# Altium schematic sheet boxer_main.SchDoc: Raspberry Pi Zero W
size A4; DrawnBy: Damian Dolewski; Engineer: Damian Dolewski; DocumentNumber: 1; SheetNumber: 1; SheetTotal: 3
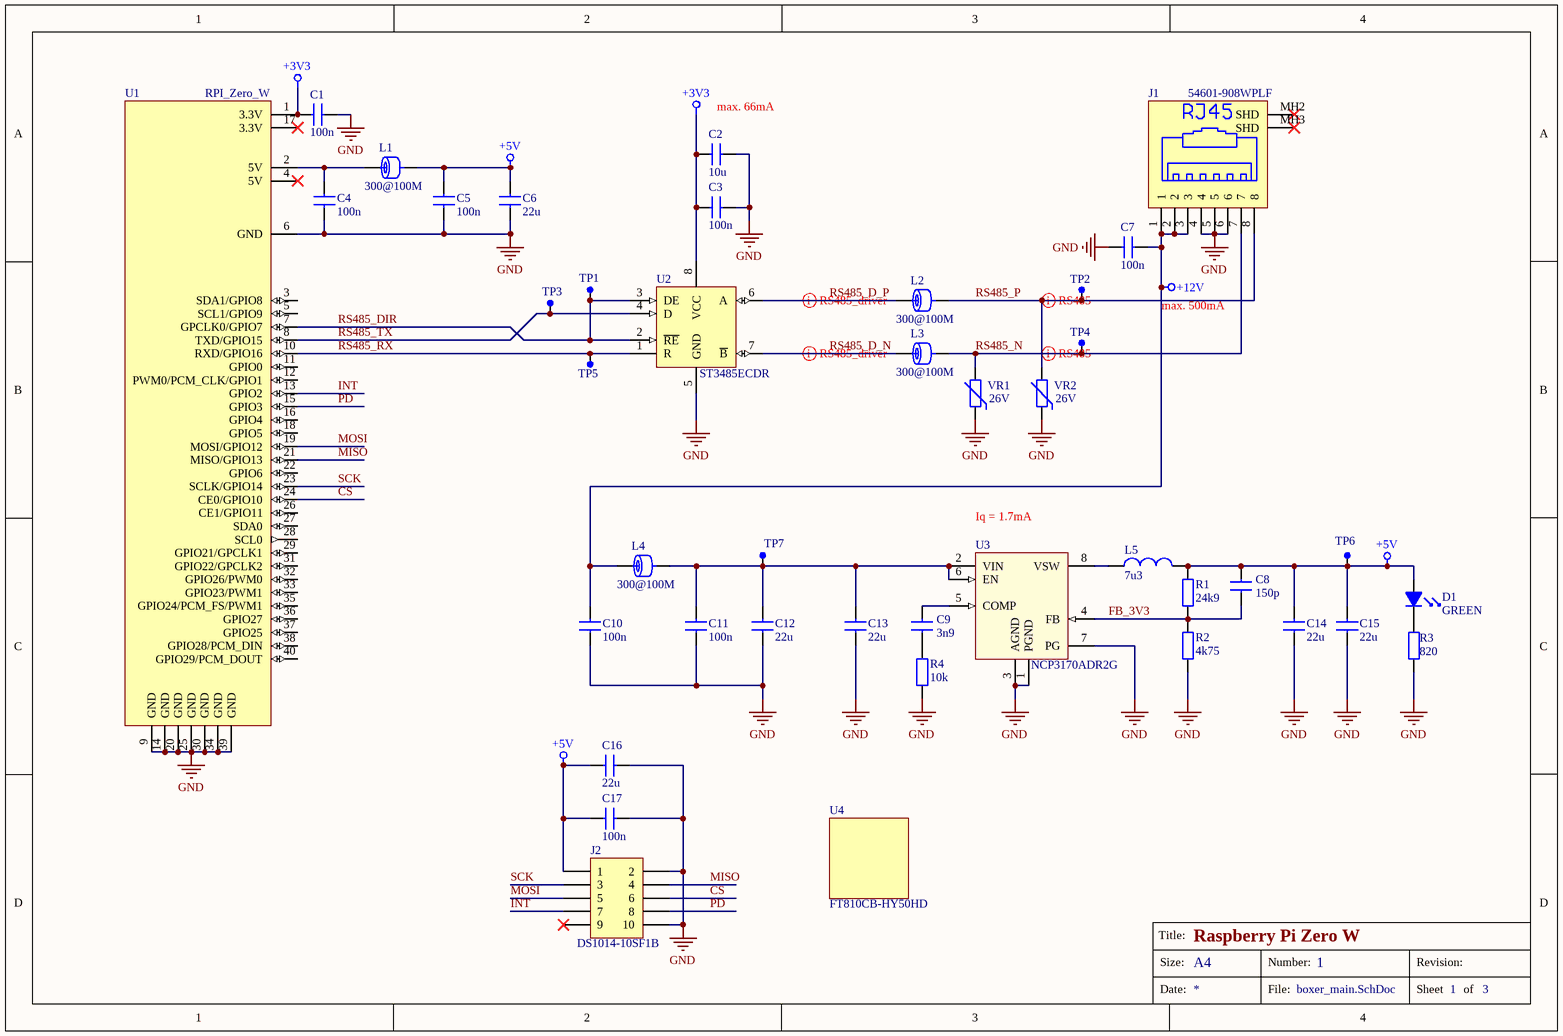
[diagram p0: boxer_main.SchDoc]

## Parts
C1  value 100n  [C_0805]  (hidden comment: Capacitor)
C2  value 10u  [C_1206]  (hidden comment: TME: CL31A226MOCLNNC)
C3  value 100n  [C_0805]  (hidden comment: Capacitor)
C4  value 100n  [C_0805]  (hidden comment: Capacitor)
C5  value 100n  [C_0805]  (hidden comment: Capacitor)
C6  value 22u  [C_1206]  (hidden comment: TME: CL31A226MOCLNNC)
C7  value 100n  [C_0805]  (hidden comment: Capacitor)
C8  value 150p  [C_0805]  (hidden comment: 885012207081)
C9  value 3n9  [C_0805]  (hidden comment: 885012207089)
C10  value 100n  [C_0805]  (hidden comment: Capacitor)
C11  value 100n  [C_0805]  (hidden comment: Capacitor)
C12  value 22u  [C_1206]  (hidden comment: TME: CL31A226MOCLNNC)
C13  value 22u  [C_1206]  (hidden comment: TME: CL31A226MOCLNNC)
C14  value 22u  [C_1206]  (hidden comment: TME: CL31A226MOCLNNC)
C15  value 22u  [C_1206]  (hidden comment: TME: CL31A226MOCLNNC)
C16  value 22u  [C_1206]  (hidden comment: TME: CL31A226MOCLNNC)
C17  value 100n  [C_0805]  (hidden comment: Capacitor)
D1  value GREEN  [LED_0805]  (hidden comment: KP-2012LSGC)
J1  54601-908WPLF  [RJ45_54601-908WPLF]
J2  value DS1014-10SF1B  [215307-5]  (hidden comment: Header 5X2)
L1  value 300@100M  [L_0805]  (hidden comment: 742792031)
L2  value 300@100M  [L_0805]  (hidden comment: 742792031)
L3  value 300@100M  [L_0805]  (hidden comment: 742792031)
L4  value 300@100M  [L_0805]  (hidden comment: 742792031)
L5  value 7u3  [L_6.7x6.7mm]  (hidden comment: 308-1500-1-ND)
R1  value 24k9  [R_0805]  (hidden comment: RNCP0805FTD24K9)
R2  value 4k75  [R_0805]  (hidden comment: RNCP0805FTD4K75)
R3  value 820  [R_0805]  (hidden comment: Resistor)
R4  value 10k  [R_1206]  (hidden comment: Resistor)
TP1  TEST PAD  [PIN]  (value not drawn)
TP2  TEST PAD  [PIN]  (value not drawn)
TP3  TEST PAD  [PIN]  (value not drawn)
TP4  TEST PAD  [PIN]  (value not drawn)
TP5  TEST PAD  [PIN]  (value not drawn)
TP6  TEST PAD  [PIN]  (value not drawn)
TP7  TEST PAD  [PIN]  (value not drawn)
U1  RPI_Zero_W  [RPI_ZERO]
U2  ST3485ECDR  [SO8]
U3  NCP3170ADR2G  [SO8]
U4  FT810CB-HY50HD  [FT810CB-HY50HD]
VR1  value 26V  [VR_0805]  (hidden comment: AMCV-0805-260-C800N-T)
VR2  value 26V  [VR_0805]  (hidden comment: AMCV-0805-260-C800N-T)

## Nets
+3V3: C1.2 C2.2 C3.1 U1.1(3.3V) U2.8(VCC)
+5V: C5.1 C6.2 C8.2 C14.2 C15.2 C16.2 C17.2 D1.1(A) J2.1 L1.2 L5.2 R1.2 TP6.1
+12V: C7.1 C10.2 J1.1 J1.2 J1.3 L4.1
GND: C1.1 C2.1 C3.2 C4.2 C5.2 C6.1 C7.2 C10.1 C11.1 C12.1 C13.1 C14.1 C15.1 C16.1 C17.1 J1.4 J1.5 J1.6 J2.2 J2.10 R2.1 R3.1 R4.1 U1.6(GND) U1.9(GND) U1.14(GND) U1.20(GND) U1.25(GND) U1.30(GND) U1.34(GND) U1.39(GND) U2.5(GND) U3.1(PGND) U3.3(AGND) U3.7(PG) VR1.2 VR2.2
CS: J2.6 U1.24(CE0/GPIO10)
FB_3V3: C8.1 R1.1 R2.2 U3.4(FB)
INT: J2.7 U1.13(GPIO2)
MISO: J2.4 U1.21(MISO/GPIO13)
MOSI: J2.5 U1.19(MOSI/GPIO12)
PD: J2.8 U1.15(GPIO3)
RS485_D_N: L3.1 U2.7(~{B})
RS485_D_P: L2.1 U2.6(A)
RS485_DIR: TP1.1 U1.7(GPCLK0/GPIO7) U2.2(~{RE}) U2.3(DE)
RS485_N: J1.7 L3.2 TP4.1 VR1.1
RS485_P: J1.8 L2.2 TP2.1 VR2.1
RS485_RX: TP5.1 U1.10(RXD/GPIO16) U2.1(R)
RS485_TX: TP3.1 U1.8(TXD/GPIO15) U2.4(D)
SCK: J2.3 U1.23(SCLK/GPIO14)
NetC4_1: C4.1 L1.1 U1.2(5V)
NetC9_1: C9.1 R4.2
NetC9_2: C9.2 U3.5(COMP)
NetC11_2: C11.2 C12.2 C13.2 L4.2 TP7.1 U3.2(VIN) U3.6(EN)
NetD1_2: D1.2(K) R3.2
NetL5_1: L5.1 U3.8(VSW)

Not connected (* = marked no-connect by the designer): J1 MH2(SHD)* MH3(SHD)*; J2 9*; U1 3(SDA1/GPIO8) 4(5V)* 5(SCL1/GPIO9) 11(GPIO0) 12(PWM0/PCM_CLK/GPIO1) 16(GPIO4) 17(3.3V)* 18(GPIO5) 22(GPIO6) 26(CE1/GPIO11) 27(SDA0) 28(SCL0) 29(GPIO21/GPCLK1) 31(GPIO22/GPCLK2) 32(GPIO26/PWM0) 33(GPIO23/PWM1) 35(GPIO24/PCM_FS/PWM1) 36(GPIO27) 37(GPIO25) 38(GPIO28/PCM_DIN) 40(GPIO29/PCM_DOUT)

## Layout directives
differential pair: RS485_D_N, RS485_D_P, RS485_N, RS485_P

## Notes on the sheet
- (near C2) max. 66mA
- max. 500mA
- (near U3) Iq = 1.7mA
- Title:
- Size:
- A4
- Number:
- Revision:
- Date:
- File:
- Sheet
- of

## Library data of the parts
C2 C6 C8 C9 C12-C16 = Capacitor
D1 = LED: Typical RED, GREEN, YELLOW, AMBER GaAs LED
J1 = RJ45-8: RJ45 Socket, 8pin, No Key, Molex MX-95001-2881; Value: 54601-908WPLF
J2 = Header 5X2: Header, 5-Pin, Dual row
L1-L4 = FB: Ferrite Bead
L5 = Inductor: FIXED IND 7.3UH 2.1A 54 MOHM SMD
R1 R2 = Resistor
TP1-TP7 = TEST_PAD: PAD 1.5mm
U1 = RPI_Zero_W: Raspberry Pi Zero W
U2 = ST485BDR: RS-422/RS-485 Interface IC Hi-Spd Lo Pwr Trans; ComponentLink1Description: Manufacturer Link; ComponentLink1URL: http://www.ti.com/; ComponentLink2Description: Datasheet; ComponentLink2URL: http://www-s.ti.com/sc/ds/sn75176b.pdf; Value: ST3485ECDR
U3 = NCP3170: Synchronous PWM Switching Converter; Value: NCP3170ADR2G
VR1 VR2 = Varistor: 34.5V 20A Varistor 1 Circuit Surface Mount, MLCV 0805 (2012 Metric)